# Altium schematic sheet con-right-top.SchDoc: SigJumper-Bottom - Right Top
size Letter; CheckedBy: J. Brinton; CompanyName: Signal Laboratories, Inc.; DrawnBy: J. Brinton; Engineer: J. Brinton; Address1: 3479 Edison Way; Address2: Menlo Park CA 94025; Address3: +1 (877) 778-8435; Address4: siglabs.com; Revision: 2; SheetNumber: 2; SheetTotal: 4
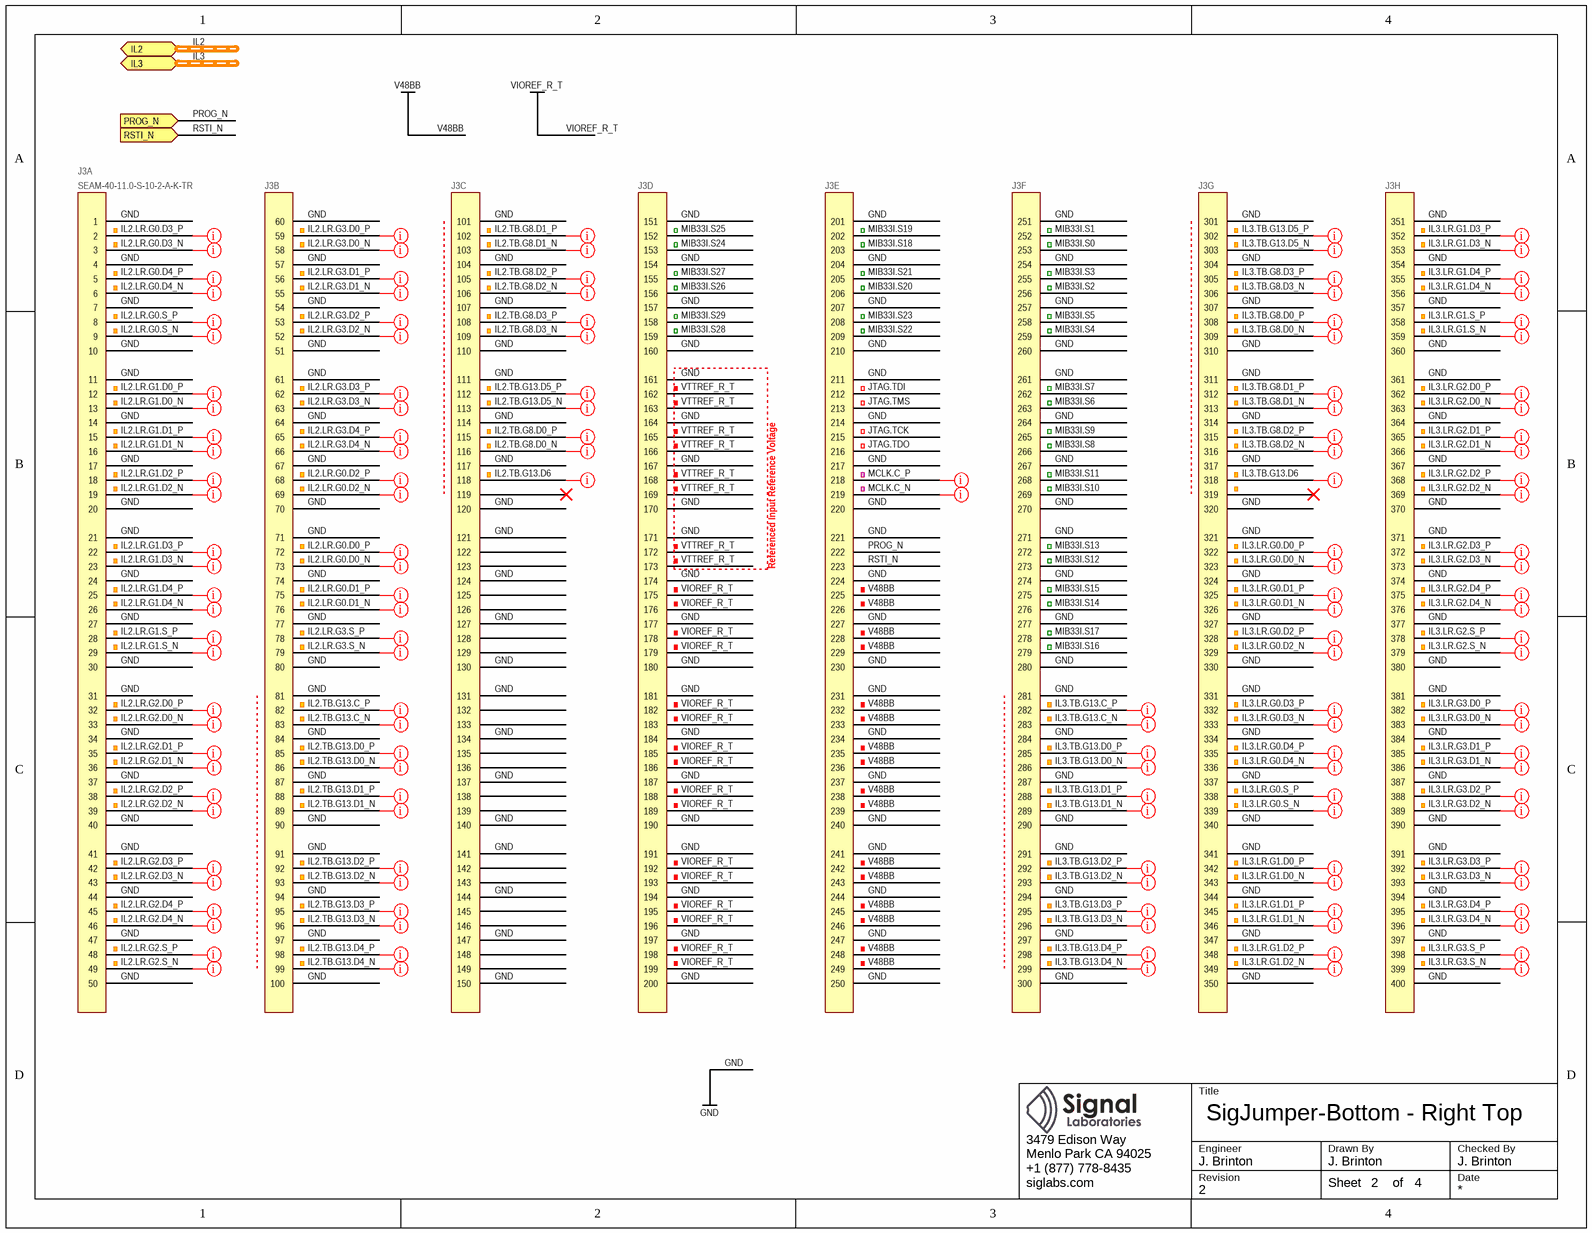
[diagram p0: con-right-top.SchDoc]

## Parts
J3  SEAM-40-11.0-S-10-2-A-K-TR  [SEAM-40-11.0-S-10-2-A-K-TR]  (parts A,B,C,D,E,F,G,H of 8)

## Ports
IL2 (harness IL-1V35), IL3 (harness IL-1V35), PROG_N (in), RSTI_N (in)

## Nets
GND: J3.1 J3.4 J3.7 J3.10 J3.11 J3.14 J3.17 J3.20 J3.21 J3.24 J3.27 J3.30 J3.31 J3.34 J3.37 J3.40 J3.41 J3.44 J3.47 J3.50 J3.51 J3.54 J3.57 J3.60 J3.61 J3.64 J3.67 J3.70 J3.71 J3.74 J3.77 J3.80 J3.81 J3.84 J3.87 J3.90 J3.91 J3.94 J3.97 J3.100 J3.101 J3.104 J3.107 J3.110 J3.111 J3.114 J3.117 J3.120 J3.121 J3.124 J3.127 J3.130 J3.131 J3.134 J3.137 J3.140 J3.141 J3.144 J3.147 J3.150 J3.151 J3.154 J3.157 J3.160 J3.161 J3.164 J3.167 J3.170 J3.171 J3.174 J3.177 J3.180 J3.181 J3.184 J3.187 J3.190 J3.191 J3.194 J3.197 J3.200 J3.201 J3.204 J3.207 J3.210 J3.211 J3.214 J3.217 J3.220 J3.221 J3.224 J3.227 J3.230 J3.231 J3.234 J3.237 J3.240 J3.241 J3.244 J3.247 J3.250 J3.251 J3.254 J3.257 J3.260 J3.261 J3.264 J3.267 J3.270 J3.271 J3.274 J3.277 J3.280 J3.281 J3.284 J3.287 J3.290 J3.291 J3.294 J3.297 J3.300 J3.301 J3.304 J3.307 J3.310 J3.311 J3.314 J3.317 J3.320 J3.321 J3.324 J3.327 J3.330 J3.331 J3.334 J3.337 J3.340 J3.341 J3.344 J3.347 J3.350 J3.351 J3.354 J3.357 J3.360 J3.361 J3.364 J3.367 J3.370 J3.371 J3.374 J3.377 J3.380 J3.381 J3.384 J3.387 J3.390 J3.391 J3.394 J3.397 J3.400
V48BB: J3.225 J3.226 J3.228 J3.229 J3.232 J3.233 J3.235 J3.236 J3.238 J3.239 J3.242 J3.243 J3.245 J3.246 J3.248 J3.249
VIOREF_R_T: J3.175 J3.176 J3.178 J3.179 J3.182 J3.183 J3.185 J3.186 J3.188 J3.189 J3.192 J3.193 J3.195 J3.196 J3.198 J3.199
IL2.LR.G0.D0_N: J3.73
IL2.LR.G0.D0_P: J3.72
IL2.LR.G0.D1_N: J3.76
IL2.LR.G0.D1_P: J3.75
IL2.LR.G0.D2_N: J3.69
IL2.LR.G0.D2_P: J3.68
IL2.LR.G0.D3_N: J3.3
IL2.LR.G0.D3_P: J3.2
IL2.LR.G0.D4_N: J3.6
IL2.LR.G0.D4_P: J3.5
IL2.LR.G0.S_N: J3.9
IL2.LR.G0.S_P: J3.8
IL2.LR.G1.D0_N: J3.13
IL2.LR.G1.D0_P: J3.12
IL2.LR.G1.D1_N: J3.16
IL2.LR.G1.D1_P: J3.15
IL2.LR.G1.D2_N: J3.19
IL2.LR.G1.D2_P: J3.18
IL2.LR.G1.D3_N: J3.23
IL2.LR.G1.D3_P: J3.22
IL2.LR.G1.D4_N: J3.26
IL2.LR.G1.D4_P: J3.25
IL2.LR.G1.S_N: J3.29
IL2.LR.G1.S_P: J3.28
IL2.LR.G2.D0_N: J3.33
IL2.LR.G2.D0_P: J3.32
IL2.LR.G2.D1_N: J3.36
IL2.LR.G2.D1_P: J3.35
IL2.LR.G2.D2_N: J3.39
IL2.LR.G2.D2_P: J3.38
IL2.LR.G2.D3_N: J3.43
IL2.LR.G2.D3_P: J3.42
IL2.LR.G2.D4_N: J3.46
IL2.LR.G2.D4_P: J3.45
IL2.LR.G2.S_N: J3.49
IL2.LR.G2.S_P: J3.48
IL2.LR.G3.D0_N: J3.58
IL2.LR.G3.D0_P: J3.59
IL2.LR.G3.D1_N: J3.55
IL2.LR.G3.D1_P: J3.56
IL2.LR.G3.D2_N: J3.52
IL2.LR.G3.D2_P: J3.53
IL2.LR.G3.D3_N: J3.63
IL2.LR.G3.D3_P: J3.62
IL2.LR.G3.D4_N: J3.66
IL2.LR.G3.D4_P: J3.65
IL2.LR.G3.S_N: J3.79
IL2.LR.G3.S_P: J3.78
IL2.TB.G8.D0_N: J3.116
IL2.TB.G8.D0_P: J3.115
IL2.TB.G8.D1_N: J3.103
IL2.TB.G8.D1_P: J3.102
IL2.TB.G8.D2_N: J3.106
IL2.TB.G8.D2_P: J3.105
IL2.TB.G8.D3_N: J3.109
IL2.TB.G8.D3_P: J3.108
IL2.TB.G13.C_N: J3.83
IL2.TB.G13.C_P: J3.82
IL2.TB.G13.D0_N: J3.86
IL2.TB.G13.D0_P: J3.85
IL2.TB.G13.D1_N: J3.89
IL2.TB.G13.D1_P: J3.88
IL2.TB.G13.D2_N: J3.93
IL2.TB.G13.D2_P: J3.92
IL2.TB.G13.D3_N: J3.96
IL2.TB.G13.D3_P: J3.95
IL2.TB.G13.D4_N: J3.99
IL2.TB.G13.D4_P: J3.98
IL2.TB.G13.D5_N: J3.113
IL2.TB.G13.D5_P: J3.112
IL2.TB.G13.D6: J3.118
IL3.LR.G0.D0_N: J3.323
IL3.LR.G0.D0_P: J3.322
IL3.LR.G0.D1_N: J3.326
IL3.LR.G0.D1_P: J3.325
IL3.LR.G0.D2_N: J3.329
IL3.LR.G0.D2_P: J3.328
IL3.LR.G0.D3_N: J3.333
IL3.LR.G0.D3_P: J3.332
IL3.LR.G0.D4_N: J3.336
IL3.LR.G0.D4_P: J3.335
IL3.LR.G0.S_N: J3.339
IL3.LR.G0.S_P: J3.338
IL3.LR.G1.D0_N: J3.343
IL3.LR.G1.D0_P: J3.342
IL3.LR.G1.D1_N: J3.346
IL3.LR.G1.D1_P: J3.345
IL3.LR.G1.D2_N: J3.349
IL3.LR.G1.D2_P: J3.348
IL3.LR.G1.D3_N: J3.353
IL3.LR.G1.D3_P: J3.352
IL3.LR.G1.D4_N: J3.356
IL3.LR.G1.D4_P: J3.355
IL3.LR.G1.S_N: J3.359
IL3.LR.G1.S_P: J3.358
IL3.LR.G2.D0_N: J3.363
IL3.LR.G2.D0_P: J3.362
IL3.LR.G2.D1_N: J3.366
IL3.LR.G2.D1_P: J3.365
IL3.LR.G2.D2_N: J3.369
IL3.LR.G2.D2_P: J3.368
IL3.LR.G2.D3_N: J3.373
IL3.LR.G2.D3_P: J3.372
IL3.LR.G2.D4_N: J3.376
IL3.LR.G2.D4_P: J3.375
IL3.LR.G2.S_N: J3.379
IL3.LR.G2.S_P: J3.378
IL3.LR.G3.D0_N: J3.383
IL3.LR.G3.D0_P: J3.382
IL3.LR.G3.D1_N: J3.386
IL3.LR.G3.D1_P: J3.385
IL3.LR.G3.D2_N: J3.389
IL3.LR.G3.D2_P: J3.388
IL3.LR.G3.D3_N: J3.393
IL3.LR.G3.D3_P: J3.392
IL3.LR.G3.D4_N: J3.396
IL3.LR.G3.D4_P: J3.395
IL3.LR.G3.S_N: J3.399
IL3.LR.G3.S_P: J3.398
IL3.TB.G8.D0_N: J3.309
IL3.TB.G8.D0_P: J3.308
IL3.TB.G8.D1_N: J3.313
IL3.TB.G8.D1_P: J3.312
IL3.TB.G8.D2_N: J3.316
IL3.TB.G8.D2_P: J3.315
IL3.TB.G8.D3_N: J3.306
IL3.TB.G8.D3_P: J3.305
IL3.TB.G13.C_N: J3.283
IL3.TB.G13.C_P: J3.282
IL3.TB.G13.D0_N: J3.286
IL3.TB.G13.D0_P: J3.285
IL3.TB.G13.D1_N: J3.289
IL3.TB.G13.D1_P: J3.288
IL3.TB.G13.D2_N: J3.293
IL3.TB.G13.D2_P: J3.292
IL3.TB.G13.D3_N: J3.296
IL3.TB.G13.D3_P: J3.295
IL3.TB.G13.D4_N: J3.299
IL3.TB.G13.D4_P: J3.298
IL3.TB.G13.D5_N: J3.303
IL3.TB.G13.D5_P: J3.302
IL3.TB.G13.D6: J3.318
JTAG.TCK: J3.215
JTAG.TDI: J3.212
JTAG.TDO: J3.216
JTAG.TMS: J3.213
MCLK.C_N: J3.219
MCLK.C_P: J3.218
MIB33I.S0: J3.253
MIB33I.S1: J3.252
MIB33I.S2: J3.256
MIB33I.S3: J3.255
MIB33I.S4: J3.259
MIB33I.S5: J3.258
MIB33I.S6: J3.263
MIB33I.S7: J3.262
MIB33I.S8: J3.266
MIB33I.S9: J3.265
MIB33I.S10: J3.269
MIB33I.S11: J3.268
MIB33I.S12: J3.273
MIB33I.S13: J3.272
MIB33I.S14: J3.276
MIB33I.S15: J3.275
MIB33I.S16: J3.279
MIB33I.S17: J3.278
MIB33I.S18: J3.203
MIB33I.S19: J3.202
MIB33I.S20: J3.206
MIB33I.S21: J3.205
MIB33I.S22: J3.209
MIB33I.S23: J3.208
MIB33I.S24: J3.153
MIB33I.S25: J3.152
MIB33I.S26: J3.156
MIB33I.S27: J3.155
MIB33I.S28: J3.159
MIB33I.S29: J3.158
PROG_N: J3.222 ; port PROG_N
RSTI_N: J3.223 ; port RSTI_N
VTTREF_R_T: J3.162 J3.163 J3.165 J3.166 J3.168 J3.169 J3.172 J3.173

Not connected (* = marked no-connect by the designer): J3 119* 122 123 125 126 128 129 132 133 135 136 138 139 142 143 145 146 148 149 319*

## Buses and harness runs
harness IL2 = port IL2
harness IL3 = port IL3

## Layout directives
net class z50: IL2.TB.G13.D6, IL3.TB.G13.D6
net class z50; differential pair; net class loose: IL2.LR.G0.D0_N, IL2.LR.G0.D0_P, IL2.LR.G0.D1_N, IL2.LR.G0.D1_P, IL2.LR.G0.D2_N, IL2.LR.G0.D2_P, IL2.LR.G0.D3_N, IL2.LR.G0.D3_P, IL2.LR.G0.D4_N, IL2.LR.G0.D4_P, IL2.LR.G0.S_N, IL2.LR.G0.S_P, IL2.LR.G1.D0_N, IL2.LR.G1.D0_P, IL2.LR.G1.D1_N, IL2.LR.G1.D1_P, IL2.LR.G1.D2_N, IL2.LR.G1.D2_P, IL2.LR.G1.D3_N, IL2.LR.G1.D3_P, IL2.LR.G1.D4_N, IL2.LR.G1.D4_P, IL2.LR.G1.S_N, IL2.LR.G1.S_P, IL2.LR.G2.D0_N, IL2.LR.G2.D0_P, IL2.LR.G2.D1_N, IL2.LR.G2.D1_P, IL2.LR.G2.D2_N, IL2.LR.G2.D2_P, IL2.LR.G2.D3_N, IL2.LR.G2.D3_P, IL2.LR.G2.D4_N, IL2.LR.G2.D4_P, IL2.LR.G2.S_N, IL2.LR.G2.S_P, IL2.LR.G3.D0_N, IL2.LR.G3.D0_P, IL2.LR.G3.D1_N, IL2.LR.G3.D1_P, IL2.LR.G3.D2_N, IL2.LR.G3.D2_P, IL2.LR.G3.D3_N, IL2.LR.G3.D3_P, IL2.LR.G3.D4_N, IL2.LR.G3.D4_P, IL2.LR.G3.S_N, IL2.LR.G3.S_P, IL2.TB.G8.D0_N, IL2.TB.G8.D0_P, IL2.TB.G8.D1_N, IL2.TB.G8.D1_P, IL2.TB.G8.D2_N, IL2.TB.G8.D2_P, IL2.TB.G8.D3_N, IL2.TB.G8.D3_P, IL2.TB.G13.C_N, IL2.TB.G13.C_P, IL2.TB.G13.D0_N, IL2.TB.G13.D0_P, IL2.TB.G13.D1_N, IL2.TB.G13.D1_P, IL2.TB.G13.D2_N, IL2.TB.G13.D2_P, IL2.TB.G13.D3_N, IL2.TB.G13.D3_P, IL2.TB.G13.D4_N, IL2.TB.G13.D4_P, IL2.TB.G13.D5_N, IL2.TB.G13.D5_P, IL3.LR.G0.D0_N, IL3.LR.G0.D0_P, IL3.LR.G0.D1_N, IL3.LR.G0.D1_P, IL3.LR.G0.D2_N, IL3.LR.G0.D2_P, IL3.LR.G0.D3_N, IL3.LR.G0.D3_P, IL3.LR.G0.D4_N, IL3.LR.G0.D4_P, IL3.LR.G0.S_N, IL3.LR.G0.S_P, IL3.LR.G1.D0_N, IL3.LR.G1.D0_P, IL3.LR.G1.D1_N, IL3.LR.G1.D1_P, IL3.LR.G1.D2_N, IL3.LR.G1.D2_P, IL3.LR.G1.D3_N, IL3.LR.G1.D3_P, IL3.LR.G1.D4_N, IL3.LR.G1.D4_P, IL3.LR.G1.S_N, IL3.LR.G1.S_P, IL3.LR.G2.D0_N, IL3.LR.G2.D0_P, IL3.LR.G2.D1_N, IL3.LR.G2.D1_P, IL3.LR.G2.D2_N, IL3.LR.G2.D2_P, IL3.LR.G2.D3_N, IL3.LR.G2.D3_P, IL3.LR.G2.D4_N, IL3.LR.G2.D4_P, IL3.LR.G2.S_N, IL3.LR.G2.S_P, IL3.LR.G3.D0_N, IL3.LR.G3.D0_P, IL3.LR.G3.D1_N, IL3.LR.G3.D1_P, IL3.LR.G3.D2_N, IL3.LR.G3.D2_P, IL3.LR.G3.D3_N, IL3.LR.G3.D3_P, IL3.LR.G3.D4_N, IL3.LR.G3.D4_P, IL3.LR.G3.S_N, IL3.LR.G3.S_P, IL3.TB.G8.D0_N, IL3.TB.G8.D0_P, IL3.TB.G8.D1_N, IL3.TB.G8.D1_P, IL3.TB.G8.D2_N, IL3.TB.G8.D2_P, IL3.TB.G8.D3_N, IL3.TB.G8.D3_P, IL3.TB.G13.C_N, IL3.TB.G13.C_P, IL3.TB.G13.D0_N, IL3.TB.G13.D0_P, IL3.TB.G13.D1_N, IL3.TB.G13.D1_P, IL3.TB.G13.D2_N, IL3.TB.G13.D2_P, IL3.TB.G13.D3_N, IL3.TB.G13.D3_P, IL3.TB.G13.D4_N, IL3.TB.G13.D4_P, IL3.TB.G13.D5_N, IL3.TB.G13.D5_P
net class z50; differential pair; net class tight: MCLK.C_N, MCLK.C_P

## Notes on the sheet
- Referenced Input Reference Voltage
- Title
- Engineer
- Revision
- Drawn By
- Checked By
- Date
- Sheet
- of

## Library data of the parts
J3 = SEAM-40-11.0-S-10-2-A-K-TR: Terminal Array Assembly, Surface Mount, 0.050" Pitch, 400 Pins; Manufacturer: Samtec; Manufacturer P/N: SEAM-40-11.0-S-10-2-A-K-TR